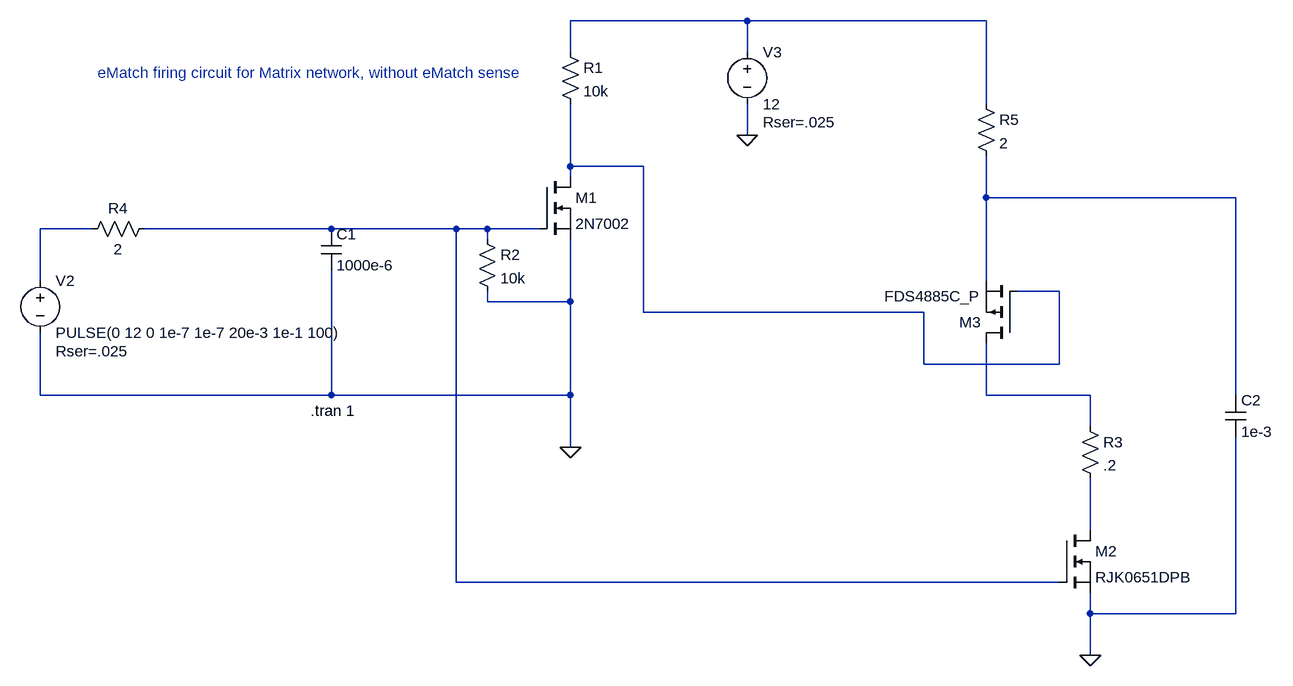
[diagram p0: schematic 4Simultaneous.asc]
4Simultaneous.asc, the LTspice schematic file:
Version 4
SHEET 1 1420 900
WIRE 432 -96 160 -96
WIRE 800 -96 432 -96
WIRE 160 -48 160 -96
WIRE 432 -48 432 -96
WIRE 800 32 800 -96
WIRE 432 80 432 32
WIRE 160 128 160 32
WIRE 272 128 160 128
WIRE 160 144 160 128
WIRE 800 176 800 112
WIRE 1184 176 800 176
WIRE -576 224 -656 224
WIRE -208 224 -496 224
WIRE -16 224 -208 224
WIRE 32 224 -16 224
WIRE 112 224 32 224
WIRE 32 240 32 224
WIRE -656 304 -656 224
WIRE 800 304 800 176
WIRE 912 320 848 320
WIRE 32 336 32 320
WIRE 160 336 160 240
WIRE 160 336 32 336
WIRE 272 352 272 128
WIRE 704 352 272 352
WIRE 704 432 704 352
WIRE 912 432 912 320
WIRE 912 432 704 432
WIRE -656 480 -656 384
WIRE -208 480 -208 288
WIRE -208 480 -656 480
WIRE 160 480 160 336
WIRE 160 480 -208 480
WIRE 800 480 800 400
WIRE 960 480 800 480
WIRE 1184 480 1184 176
WIRE 960 528 960 480
WIRE 160 560 160 480
WIRE 960 688 960 608
WIRE -16 768 -16 224
WIRE 912 768 -16 768
WIRE 960 816 960 784
WIRE 1184 816 1184 544
WIRE 1184 816 960 816
WIRE 960 880 960 816
FLAG 160 560 0
FLAG 432 80 0
FLAG 960 880 0
SYMBOL nmos 112 144 R0
SYMATTR InstName M1
SYMATTR Value 2N7002
SYMBOL res 144 -64 R0
SYMATTR InstName R1
SYMATTR Value 10k
SYMBOL res 16 224 R0
SYMATTR InstName R2
SYMATTR Value 10k
SYMBOL voltage -656 288 R0
WINDOW 123 0 0 Left 2
WINDOW 39 24 124 Left 2
SYMATTR SpiceLine Rser=.025
SYMATTR InstName V2
SYMATTR Value PULSE(0 12 0 1e-7 1e-7 20e-3 1e-1 100)
SYMBOL voltage 432 -64 R0
WINDOW 123 0 0 Left 2
WINDOW 39 24 124 Left 2
SYMATTR SpiceLine Rser=.025
SYMATTR InstName V3
SYMATTR Value 12
SYMBOL res 944 512 R0
SYMATTR InstName R3
SYMATTR Value .2
SYMBOL pmos 848 400 R180
SYMATTR InstName M3
SYMATTR Value FDS4885C_P
SYMBOL nmos 912 688 R0
SYMATTR InstName M2
SYMATTR Value RJK0651DPB
SYMBOL res -480 208 R90
WINDOW 0 0 56 VBottom 2
WINDOW 3 32 56 VTop 2
SYMATTR InstName R4
SYMATTR Value 2
SYMBOL cap -224 224 R0
SYMATTR InstName C1
SYMATTR Value 1000e-6
SYMBOL cap 1168 480 R0
SYMATTR InstName C2
SYMATTR Value 1e-3
SYMBOL res 784 16 R0
SYMATTR InstName R5
SYMATTR Value 2
TEXT -240 504 Left 2 !.tran 1
TEXT -568 -16 Left 2 ;eMatch firing circuit for Matrix network, without eMatch sense

The netlist it stands for:
* 4Simultaneous.asc
M1 N002 N005 0 0 2N7002
R1 N001 N002 10k
R2 N005 0 10k
V2 N004 0 PULSE(0 12 0 1e-7 1e-7 20e-3 1e-1 100) Rser=.025
V3 N001 0 12 Rser=.025
R3 N006 N007 .2
M3 N006 N002 N003 N003 FDS4885C_P
M2 N007 N005 0 0 RJK0651DPB
R4 N005 N004 2
C1 N005 0 1000e-6
C2 N003 0 1e-3
R5 N001 N003 2
.model NMOS NMOS
.model PMOS PMOS
.lib standard.mos
.tran 1
* eMatch firing circuit for Matrix network, without eMatch sense
.backanno
.end